# EAGLE board CB_1-2 (EAGLE 7.2.0), part 1 of 3
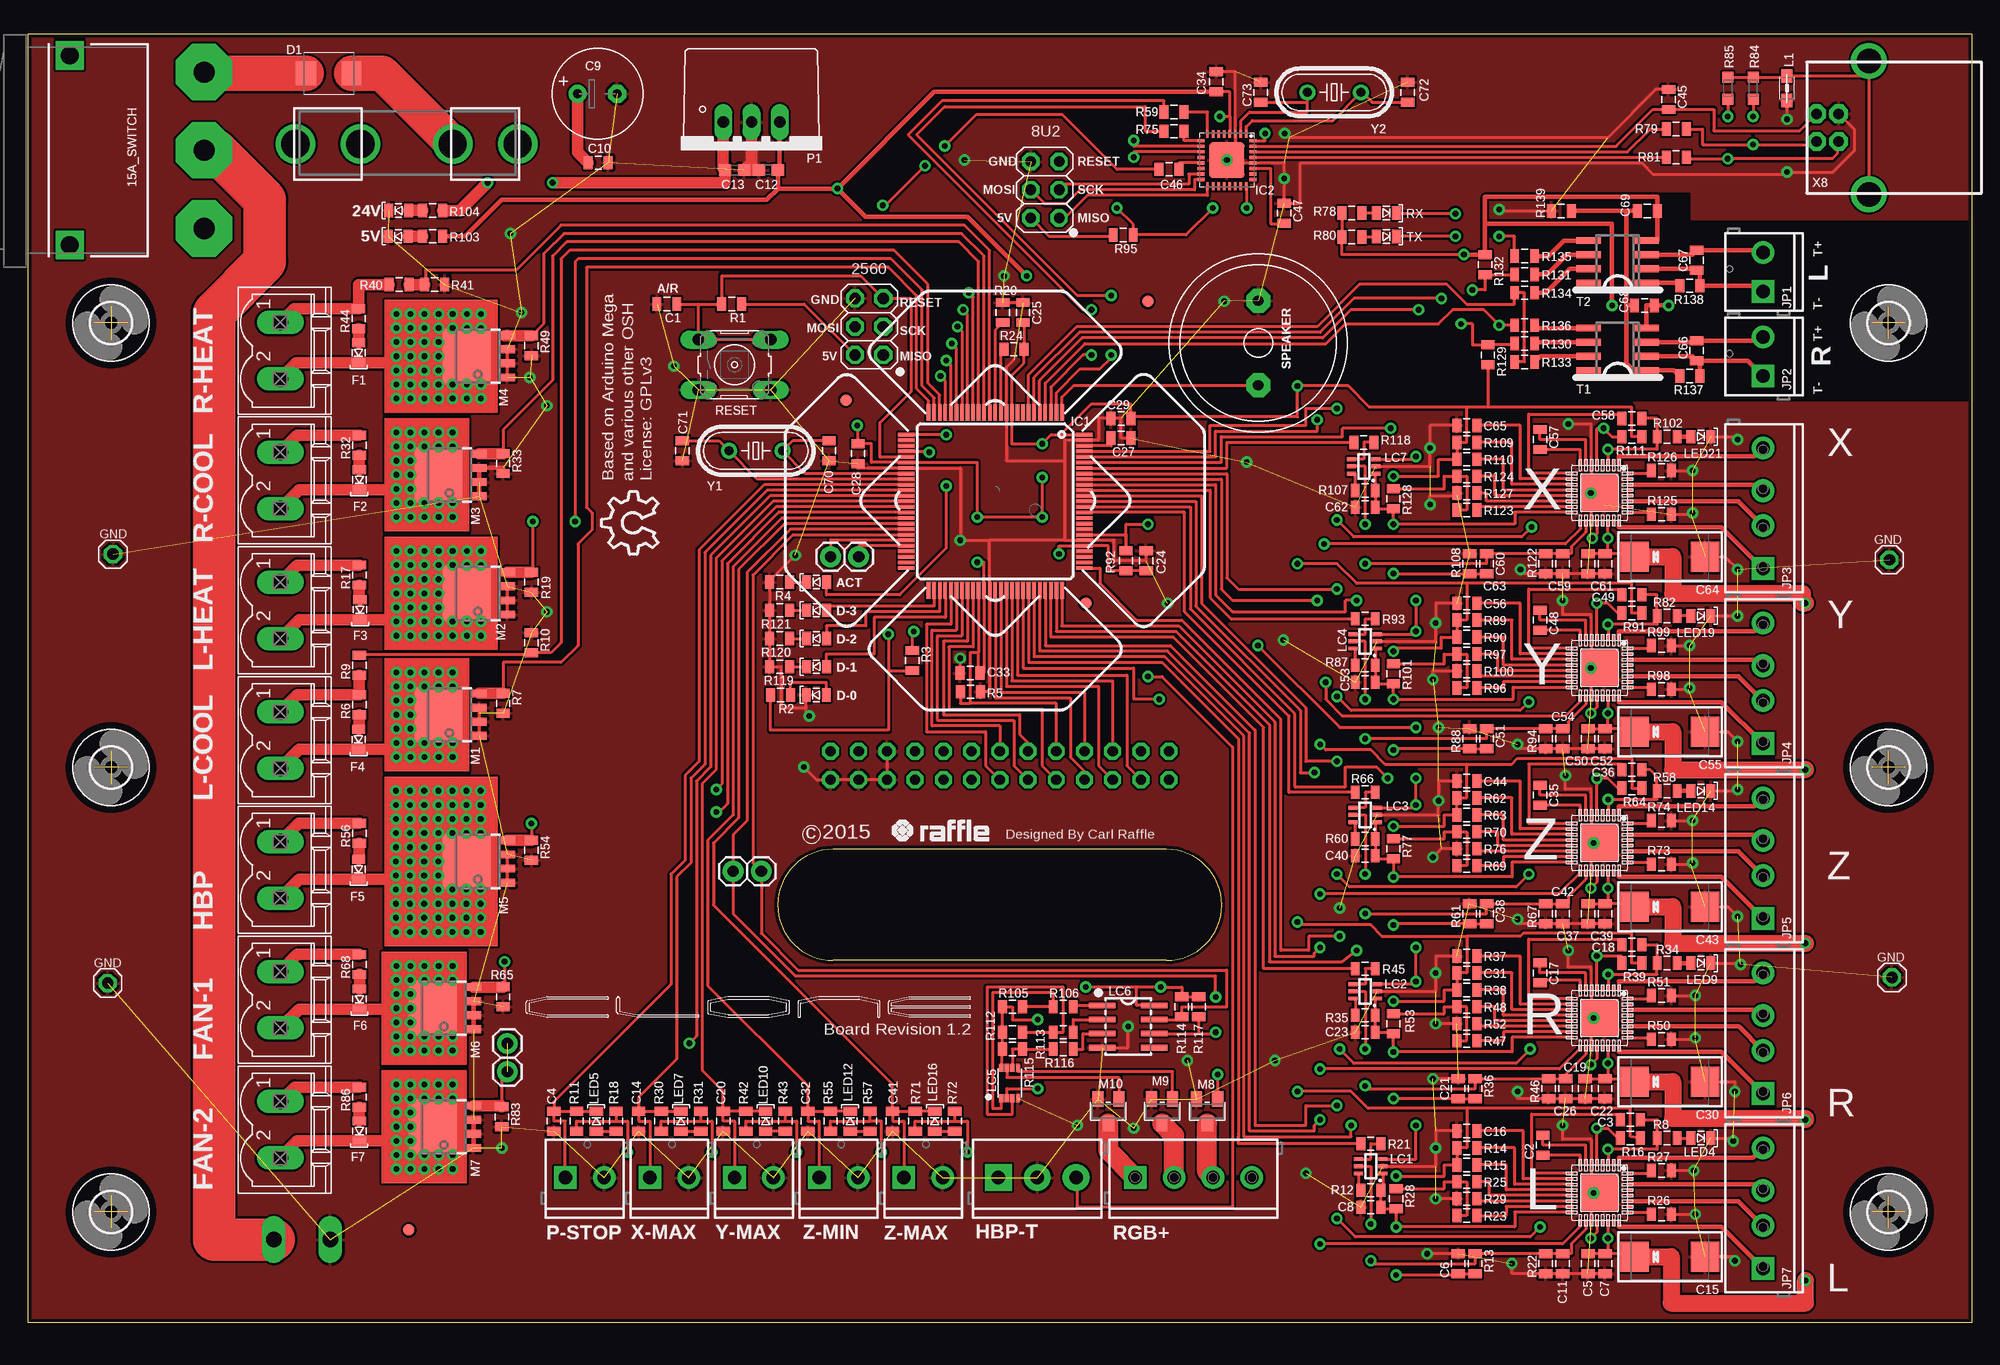
[diagram p5: board, top side]
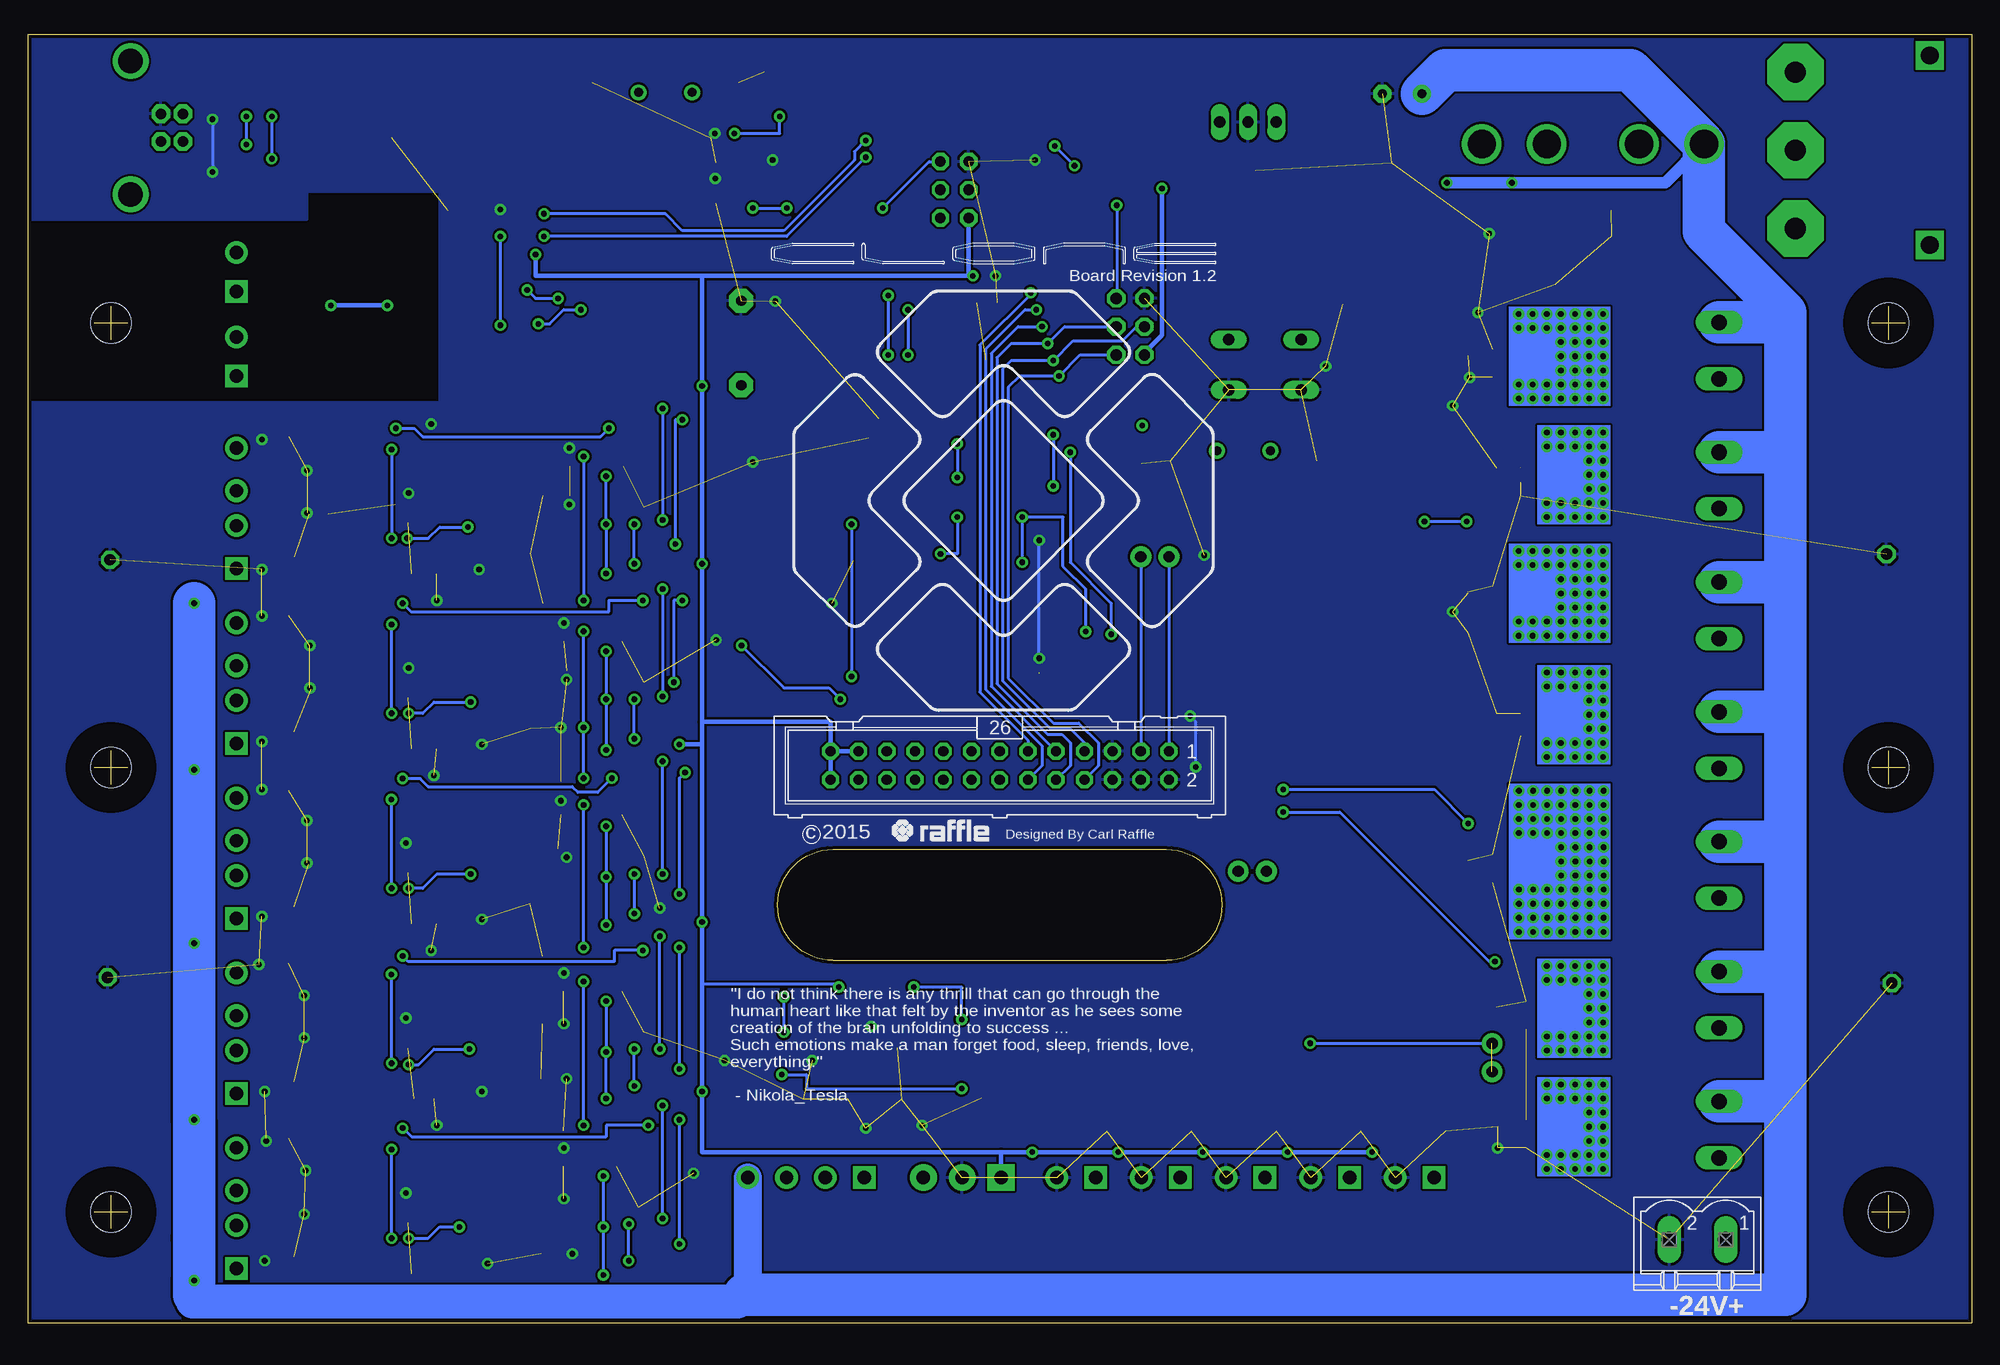
[diagram p6: board, bottom side, seen from below]

Size 175 x 116 mm. Coordinates in mm from the lower left corner, seen from the top.
Outline: 167.5,88.5 167.5,91.5
Outline: 169,90 166,90
Outline: 7.5,91.5 7.5,88.5
Outline: 9,90 6,90
Outline: 167.5,48.5 167.5,51.5
Outline: 169,50 166,50
Outline: 7.5,51.5 7.5,48.5
Outline: 9,50 6,50
Outline: 167.5,8.5 167.5,11.5
Outline: 169,10 166,10
Outline: 7.5,11.5 7.5,8.5
Outline: 9,10 6,10
Outline: 175,116 175,0 0,0 0,116 175,116
Outline: 102.5,42.62 72.5,42.62 arc180 72.5,32.62 102.5,32.62 arc180 102.5,42.62
Copper layers (1*16): Top 0.035mm / dielectric 1.5mm / Bottom 0.035mm
Design rules "default *": minimum track width 8mil, minimum drill 20mil, track to track 8mil, track to pad 8mil, pad to pad 8mil, via to via 8mil, smd to smd 8mil, copper to edge 10mil, drill to drill 8mil, minimum pad ring 12mil, minimum via ring 10mil, stop-mask expansion 4mil, vias tented up to drill 25mil, thermal gap 10mil
Net classes: 0 default: width 0.203 mm, drill 0.508 mm, clearance 0.203 mm; 1 24V: width 0.889 mm, drill 0.635 mm, clearance 0.508 mm; 2 gnd: width 0.381 mm, drill 0.508 mm, clearance 0.254 mm; 3 5V: width 0.381 mm, drill 0.508 mm, clearance 0.254 mm; 4 3.3V: width 0.381 mm, drill 0.508 mm, clearance 0.254 mm

## Footprints (pad centres in the part's own frame; a part is rotated, then mirrored left to right if it is on the bottom)
LED-0805 = smd 1.2 x 0.8: A 0,-0.9; C 0,0.9
D501JT2S2APQF = drill 1.905 pad 5.08 octagon: 1 0,0; 1A 0,7.036; 1B 0,-7.036 | drill 1.6 pad 2.54 square: SLD1 -12.09,8.534; SLD2 -12.09,-8.534
MSTBV2 = drill 1.397 long: 1 -2.54,0; 2 2.54,0
ETSSOP32 = smd 2.54 x 1.27: EPAD 2.098,3.566; EPAD1 2.098,2.296; EPAD2 2.098,1.433 | smd 1.27 x 2.54: EPAD3 3.597,2.936; EPAD4 3.597,2.073 | smd 0.305 x 0.61: P01 0.767,-0.183; P02 1.26,-0.183; P03 1.753,-0.183; P04 2.271,-0.183; P05 2.761,-0.18; P06 3.264,-0.183; P07 3.764,-0.183; P08 4.27,-0.183; P17 4.26,5.207; P18 3.764,5.204; P19 3.272,5.207; P20 2.771,5.204; P21 2.263,5.207; P22 1.76,5.207; P23 1.27,5.207; P24 0.767,5.207 | smd 0.61 x 0.305: P09 5.204,0.759; P10 5.204,1.257; P11 5.204,1.755; P12 5.204,2.263; P13 5.207,2.756; P14 5.207,3.254; P15 5.207,3.759; P16 5.207,4.257; P25 -0.178,4.262; P26 -0.178,3.764; P27 -0.178,3.261; P28 -0.178,2.766; P29 -0.178,2.263; P30 -0.178,1.765; P31 -0.178,1.26; P32 -0.175,0.754
0805 = smd 0.8 x 1.2: 1 -0.9,0; 2 0.9,0
E3,5-8 = drill 0.813 pad 1.6: + -1.778,0 | drill 0.813 pad 1.6 octagon: - 1.778,0
C0603 = smd 1.1 x 1: 1 -0.85,0; 2 0.85,0
EIA7343-31/D-R = smd 2.55 x 2.7: + 3.175,0; - -3.175,0
SMBJ = smd 1.78 x 2.16: A 2.04,0; C -2.03,0
FIDUCIA-MOUNT = smd 1.016 x 1.016: P$1 0,0
FUSE_5MM = drill 2.54 pad 3.556: 1 0,-10; 2 0,-4.158; 3 0,4.158; 4 0,10
SCREWTERMINAL-3.5MM-3 = drill 1.2 pad 2.413 square: 1 0,0 | drill 1.2 pad 2.413: 2 3.5,0; 3 7,0
TQFP100 = smd 0.35 x 1.5: 1 -0.35,1.65; 2 -0.85,1.65; 3 -1.35,1.65; 4 -1.85,1.65; 5 -2.35,1.65; 6 -2.85,1.65; 7 -3.35,1.65; 8 -3.85,1.65; 9 -4.35,1.65; 10 -4.85,1.65; 11 -5.35,1.65; 12 -5.85,1.65; 13 -6.35,1.65; 14 -6.85,1.65; 15 -7.35,1.65; 16 -7.85,1.65; 17 -8.35,1.65; 18 -8.85,1.65; 19 -9.35,1.65; 20 -9.85,1.65; 21 -10.35,1.65; 22 -10.85,1.65; 23 -11.35,1.65; 24 -11.85,1.65; 25 -12.35,1.65; 51 -12.35,-14.35; 52 -11.85,-14.35; 53 -11.35,-14.35; 54 -10.85,-14.35; 55 -10.35,-14.35; 56 -9.85,-14.35; 57 -9.35,-14.35; 58 -8.85,-14.35; 59 -8.35,-14.35; 60 -7.85,-14.35; 61 -7.35,-14.35; 62 -6.85,-14.35; 63 -6.35,-14.35; 64 -5.85,-14.35; 65 -5.35,-14.35; 66 -4.85,-14.35; 67 -4.35,-14.35; 68 -3.85,-14.35; 69 -3.35,-14.35; 70 -2.85,-14.35; 71 -2.35,-14.35; 72 -1.85,-14.35; 73 -1.35,-14.35; 74 -0.85,-14.35; 75 -0.35,-14.35 | smd 1.5 x 0.35: 26 -14.35,-0.35; 27 -14.35,-0.85; 28 -14.35,-1.35; 29 -14.35,-1.85; 30 -14.35,-2.35; 31 -14.35,-2.85; 32 -14.35,-3.35; 33 -14.35,-3.85; 34 -14.35,-4.35; 35 -14.35,-4.85; 36 -14.35,-5.35; 37 -14.35,-5.85; 38 -14.35,-6.35; 39 -14.35,-6.85; 40 -14.35,-7.35; 41 -14.35,-7.85; 42 -14.35,-8.35; 43 -14.35,-8.85; 44 -14.35,-9.35; 45 -14.35,-9.85; 46 -14.35,-10.35; 47 -14.35,-10.85; 48 -14.35,-11.35; 49 -14.35,-11.85; 50 -14.35,-12.35; 76 1.65,-12.35; 77 1.65,-11.85; 78 1.65,-11.35; 79 1.65,-10.85; 80 1.65,-10.35; 81 1.65,-9.85; 82 1.65,-9.35; 83 1.65,-8.85; 84 1.65,-8.35; 85 1.65,-7.85; 86 1.65,-7.35; 87 1.65,-6.85; 88 1.65,-6.35; 89 1.65,-5.85; 90 1.65,-5.35; 91 1.65,-4.85; 92 1.65,-4.35; 93 1.65,-3.85; 94 1.65,-3.35; 95 1.65,-2.85; 96 1.65,-2.35; 97 1.65,-1.85; 98 1.65,-1.35; 99 1.65,-0.85; 100 1.65,-0.35
ATMEL_QFN32 = smd 0.711 x 0.305: 1 -2.351,1.75; 2 -2.351,1.25; 3 -2.351,0.75; 4 -2.351,0.25; 5 -2.351,-0.25; 6 -2.351,-0.75; 7 -2.351,-1.25; 8 -2.351,-1.75; 17 2.351,-1.75; 18 2.351,-1.25; 19 2.351,-0.75; 20 2.351,-0.25; 21 2.351,0.25; 22 2.351,0.75; 23 2.351,1.25; 24 2.351,1.75 | smd 0.305 x 0.711: 9 -1.75,-2.351; 10 -1.25,-2.351; 11 -0.75,-2.351; 12 -0.25,-2.351; 13 0.25,-2.351; 14 0.75,-2.351; 15 1.25,-2.351; 16 1.75,-2.351; 25 1.75,2.351; 26 1.25,2.351; 27 0.75,2.351; 28 0.25,2.351; 29 -0.25,2.351; 30 -0.75,2.351; 31 -1.25,2.351; 32 -1.75,2.351 | smd 3.2 x 3.2: EXP 0,0
SCREWTERMINAL-3.5MM-2 = drill 1.2 pad 2.032 square: 1 0,0 | drill 1.2 pad 2.032: 2 3.5,0
SCREWTERMINAL-3.5MM-4_LOCK = drill 1.2 pad 2.032 square: 1 -0.178,0 | drill 1.2 pad 2.032: 2 3.678,0; 3 6.822,0; 4 10.678,0
0805' = smd 1.2 x 1: 1 -1.1,0; 2 1.1,0
SC70-6L = smd 0.35 x 0.8: 1 -0.65,-1.1; 2 0,-1.1; 3 0.65,-1.1; 4 0.65,1.1; 5 0,1.1; 6 -0.65,1.1
VSSOP8 = smd 0.4 x 0.75: 1 -0.75,-1.375; 2 -0.25,-1.375; 3 0.25,-1.375; 4 0.75,-1.375; 5 0.75,1.375; 6 0.25,1.375; 7 -0.25,1.375; 8 -0.75,1.375
SO8 = smd 0.5 x 2.388: 1 -1.905,-2.324; 2 -0.635,-2.324; 3 0.635,-2.324; 4 1.905,-2.324; 5 1.905,2.324; 6 0.635,2.324; 7 -0.635,2.324; 8 -1.905,2.324
SOT669 = smd 0.7 x 1.4: 1 -1.905,-3.92; 2 -0.635,-3.92; 3 0.635,-3.92; 4 1.905,-3.92 | smd 5 x 4.3: MB 0,-0.27
SOT-23 = smd 1 x 1.4: 1 -0.95,-1.1; 2 0.95,-1.1; 3 0,1.1
R-78 = drill 1.016 long: 1 -2.54,2.54; 2 0,2.54; 3 2.54,2.54
2X03 = drill 1.016 octagon: 1 -2.54,-1.27; 2 -2.54,1.27; 3 0,-1.27; 4 0,1.27; 5 2.54,-1.27; 6 2.54,1.27
2X03' = drill 0.95 pad 1.55 octagon: 1 -2.54,-1.27; 2 -2.54,1.27; 3 0,-1.27; 4 0,1.27; 5 2.54,-1.27; 6 2.54,1.27
1X01 = drill 1.016 pad 1.88: 1 0,0
1X01' = drill 1.016 octagon: 1 0,0
CT/CN0603 = smd 1 x 1: 1 -1,0; 2 1,0
B3F-10XX = drill 1.016 long: 1 -3.251,2.261; 2 3.251,2.261; 3 -3.251,-2.261; 4 3.251,-2.261
SCREWTERMINAL-3.5MM-4 = drill 1.2 pad 2.032 square: 1 0,0 | drill 1.2 pad 2.032: 2 3.5,0; 3 7,0; 4 10.5,0
F/QMB = drill 0.914 pad 2.159 octagon: + 3.81,0; - -3.81,0
ML26 = drill 0.914 octagon: 1 -15.24,-1.27; 2 -15.24,1.27; 3 -12.7,-1.27; 4 -12.7,1.27; 5 -10.16,-1.27; 6 -10.16,1.27; 7 -7.62,-1.27; 8 -7.62,1.27; 9 -5.08,-1.27; 10 -5.08,1.27; 11 -2.54,-1.27; 12 -2.54,1.27; 13 0,-1.27; 14 0,1.27; 15 2.54,-1.27; 16 2.54,1.27; 17 5.08,-1.27; 18 5.08,1.27; 19 7.62,-1.27; 20 7.62,1.27; 21 10.16,-1.27; 22 10.16,1.27; 23 12.7,-1.27; 24 12.7,1.27; 25 15.24,-1.27; 26 15.24,1.27
SO08 = smd 0.6 x 2.2: 1 -1.905,-2.6; 2 -0.635,-2.6; 3 0.635,-2.6; 4 1.905,-2.6; 5 1.905,2.6; 6 0.635,2.6; 7 -0.635,2.6; 8 -1.905,2.6
3,6 = hole 3.6: 0,0
PN61729 = drill 0.95 pad 1.676 octagon: 1 1.25,4.71; 2 -1.25,4.71; 3 -1.25,2.71; 4 1.25,2.71 | drill 2.2: P$1 -6,0; P$2 6,0
HC49/S = drill 0.813: 1 -2.413,0; 2 2.413,0

## Placement (x,y rotation side)
5V  BLUE  [LED-0805]  33.35,97.79 90 top
15A_SWITCH  PWRSWITCH  [D501JT2S2APQF]  15.88,105.54 0 top
24V  GREEN  [LED-0805]  33.38,100.12 90 top
-24V+  MSTBV2  [MSTBV2]  24.69,7.49 180 bottom
A1  A4982ETSSOP32  [ETSSOP32]  144.02,14.22 180 top
A2  A4982ETSSOP32  [ETSSOP32]  144.02,29.95 180 top
A3  A4982ETSSOP32  [ETSSOP32]  144.02,45.72 180 top
A4  A4982ETSSOP32  [ETSSOP32]  144.02,61.47 180 top
A5  A4982ETSSOP32  [ETSSOP32]  144.02,77.22 180 top
ACT  BLUE  [LED-0805]  70.99,66.67 90 top
C1  22pF  [0805]  57.53,91.69 0 top
C2  100nF  [0805]  136.4,16 270 top
C3  100nF  [0805]  144.27,18.29 180 top
C4  100nF  [0805]  47.37,18.16 270 top
C5  100nF  [0805]  140.46,5.33 90 top
C6  100nF  [0805]  128.78,5.33 270 top
C7  100nF  [0805]  141.99,5.33 90 top
C8  100nF  [0805]  120.9,10.41 0 top
C9  100uF - 63V  [E3,5-8]  51.28,110.62 0 top
C10  100nF  [0805]  51.36,104.41 0 top
C11  100nF  [0805]  138.18,5.33 90 top
C12  .1uF  [C0603]  66.67,103.76 180 top
C13  .33uF  [C0603]  63.63,103.76 0 top
C14  100nF  [0805]  54.99,18.16 270 top
C15  47uF - 35V  [EIA7343-31/D-R]  147.83,5.97 180 top
C16  0.22uF  [0805]  129.54,17.27 180 top
C17  100nF  [0805]  136.14,31.5 270 top
C18  100nF  [0805]  144.4,34.04 180 top
C19  100nF  [0805]  140.21,21.08 90 top
C20  100nF  [0805]  62.61,18.16 270 top
C21  100nF  [0805]  128.78,21.08 270 top
C22  100nF  [0805]  141.99,21.08 90 top
C23  100nF  [0805]  120.4,26.16 0 top
C24  100nF  [0805]  100.67,68.6 90 top
C25  100nF  [0805]  89.6,90.93 90 top
C26  100nF  [0805]  138.43,21.08 90 top
C27  100nF  [0805]  98.42,79.63 0 top
C28  100nF  [0805]  74.74,78.23 270 top
C29  100nF  [0805]  98.42,81.41 180 top
C30  47uF - 35V  [EIA7343-31/D-R]  147.83,21.72 180 top
C31  0.22uF  [0805]  129.54,33.02 180 top
C32  100nF  [0805]  70.23,18.16 270 top
C33  100nF  [0805]  84.84,58.48 180 top
C34  100nF  [0805]  107,111.7 270 top
C35  100nF  [0805]  136.14,47.5 270 top
C36  100nF  [0805]  144.4,49.78 180 top
C37  100nF  [0805]  140.46,36.83 90 top
C38  100nF  [0805]  129.79,36.83 270 top
C39  100nF  [0805]  141.99,36.83 90 top
C40  100nF  [0805]  120.4,42.04 0 top
C41  100nF  [0805]  77.85,18.16 270 top
C42  100nF  [0805]  138.18,36.83 90 top
C43  47uF - 35V  [EIA7343-31/D-R]  147.83,37.47 180 top
C44  0.22uF  [0805]  129.54,48.77 180 top
C45  100nF  [0805]  147.7,110.11 270 top
C46  100nF  [0805]  102.74,103.82 180 top
C47  1uF  [0805]  113.09,99.89 270 top
C48  100nF  [0805]  136.14,63.25 270 top
C49  100nF  [0805]  144.4,65.53 180 top
C50  100nF  [0805]  140.46,52.58 90 top
C51  100nF  [0805]  129.79,52.58 270 top
C52  100nF  [0805]  141.99,52.58 90 top
C53  100nF  [0805]  120.4,57.66 0 top
C54  100nF  [0805]  138.18,52.58 90 top
C55  47uF - 35V  [EIA7343-31/D-R]  147.83,53.21 180 top
C56  0.22uF  [0805]  129.54,64.77 180 top
C57  100nF  [0805]  136.14,79.5 270 top
C58  100nF  [0805]  144.4,81.41 180 top
C59  100nF  [0805]  140.46,68.33 90 top
C60  100nF  [0805]  129.79,68.33 270 top
C61  100nF  [0805]  141.99,68.33 90 top
C62  100nF  [0805]  120.4,73.41 0 top
C63  100nF  [0805]  138.18,68.33 90 top
C64  47uF - 35V  [EIA7343-31/D-R]  147.83,68.96 180 top
C65  0.22uF  [0805]  129.54,80.77 180 top
C66  100nF  [0805]  150.24,87.5 270 top
C67  100nF  [0805]  150.24,95.63 270 top
C68  100nF  [0805]  145.54,91.57 0 top
C69  100nF  [0805]  145.8,100.08 0 top
C70  22pF  [0805]  72.14,78.49 90 top
C71  22pF  [0805]  58.93,78.49 90 top
C72  22pF  [0805]  124.21,110.74 270 top
C73  22pF  [0805]  111,110.74 270 top
D1  SMBJ24A  [SMBJ]  27.11,112.46 180 top
D-0  BLUE  [LED-0805]  70.98,56.52 90 top
D-1  YELLOW  [LED-0805]  70.99,59.05 90 top
D-2  ORANGE  [LED-0805]  70.99,61.59 90 top
D-3  RED  [LED-0805]  70.99,64.14 90 top
F1  RED  [LED-0805]  29.78,87.31 180 top
F2  Yellow  [LED-0805]  29.84,75.88 180 top
F3  RED  [LED-0805]  29.91,64.2 180 top
F4  Yellow  [LED-0805]  29.78,52.51 180 top
F5  RED  [LED-0805]  29.78,40.83 180 top
F6  Yellow  [LED-0805]  29.86,29.15 180 top
F7  Yellow  [LED-0805]  29.84,17.27 180 top
FAN-1  MSTBV2  [MSTBV2]  22.73,29.08 270 top
FAN-2  MSTBV2  [MSTBV2]  22.73,17.4 270 top
FID1  FIDUCIALMOUNT  [FIDUCIA-MOUNT]  73.66,83.06 0 top
FID2  FIDUCIALMOUNT  [FIDUCIA-MOUNT]  95.25,64.77 0 top
FID3  FIDUCIALMOUNT  [FIDUCIA-MOUNT]  34.29,8.38 0 top
FID4  FIDUCIALMOUNT  [FIDUCIA-MOUNT]  100.84,91.95 0 top
FUSE_HOLDER  FUSEX20MM  [FUSE_5MM]  34.1,106.11 270 top
HBP  MSTBV2  [MSTBV2]  22.73,40.77 270 top
HBP-T  SCREWTERMINAL-3.5MM-3  [SCREWTERMINAL-3.5MM-3]  87.38,13.08 0 top
IC1  ATMEGA2560-16AU  [TQFP100]  93.45,80.29 0 top
IC2  ATMEGA8U2-MU  [ATMEL_QFN32]  107.95,104.65 270 top
JP1  SCREWTERMINAL-3.5MM-2  [SCREWTERMINAL-3.5MM-2]  156.21,92.84 90 top
JP2  SCREWTERMINAL-3.5MM-2  [SCREWTERMINAL-3.5MM-2]  156.21,85.22 90 top
JP3  SCREWTERMINAL-3.5MM-4  [SCREWTERMINAL-3.5MM-4_LOCK]  156.21,68.07 90 top
JP4  SCREWTERMINAL-3.5MM-4  [SCREWTERMINAL-3.5MM-4_LOCK]  156.21,52.32 90 top
JP5  SCREWTERMINAL-3.5MM-4  [SCREWTERMINAL-3.5MM-4_LOCK]  156.21,36.58 90 top
JP6  SCREWTERMINAL-3.5MM-4  [SCREWTERMINAL-3.5MM-4_LOCK]  156.21,20.83 90 top
JP7  SCREWTERMINAL-3.5MM-4  [SCREWTERMINAL-3.5MM-4_LOCK]  156.21,5.08 90 top
L1  BLM21  [0805']  158.37,111.12 90 top
L-COOL  MSTBV2  [MSTBV2]  22.73,52.45 270 top
L-HEAT  MSTBV2  [MSTBV2]  22.73,64.14 270 top
LC1  MCP4018  [SC70-6L]  120.9,14.1 90 top
LC2  MCP4018  [SC70-6L]  120.4,29.84 90 top
LC3  MCP4018  [SC70-6L]  120.4,45.72 90 top
LC4  MCP4018  [SC70-6L]  120.4,61.34 90 top
LC5  74HC3G14DC  [VSSOP8]  88.39,21.59 0 top
LC6  PCA9533  [SO8]  99.06,26.67 270 top
LC7  MCP4018  [SC70-6L]  120.27,77.09 90 top
LED4  GREEN  [LED-0805]  150.62,16.64 270 top
LED5  GREEN  [LED-0805]  51.18,18.16 0 top
LED7  GREEN  [LED-0805]  58.8,18.16 0 top
LED9  GREEN  [LED-0805]  150.62,32.38 270 top
LED10  GREEN  [LED-0805]  66.42,18.16 0 top
LED12  GREEN  [LED-0805]  74.04,18.16 0 top
LED14  GREEN  [LED-0805]  150.62,47.88 270 top
LED16  GREEN  [LED-0805]  81.66,18.16 0 top
LED19  GREEN  [LED-0805]  150.62,63.63 270 top
LED21  GREEN  [LED-0805]  150.62,79.76 270 top
LOGO2  OSHW_LOGO_10MILX0200-NT  [OSHW_10X200_NOTEXT]  56.74,69.16 90 top
M1  PSMN7R0-30YL  [SOT669]  36.7,54.74 90 top
M2  PSMN7R0-30YL  [SOT669]  39.24,65.66 90 top
M3  PSMN7R0-30YL  [SOT669]  36.7,76.31 90 top
M4  PSMN7R0-30YL  [SOT669]  39.24,87 90 top
M5  PSMN7R0-30YL  [SOT669]  39.24,41.53 90 top
M6  PSMN7R0-30YL  [SOT669]  36.2,28.32 90 top
M7  PSMN7R0-30YL  [SOT669]  36.2,17.65 90 top
M8  FDV301N  [SOT-23]  106.17,19.05 180 top
M9  FDV301N  [SOT-23]  102.11,19.05 180 top
M10  FDV301N  [SOT-23]  97.28,19.05 180 top
P1  R-78E-5.0  [R-78]  65.15,105.54 0 top
P-STOP  SCREWTERMINAL-3.5MM-2  [SCREWTERMINAL-3.5MM-2]  48.39,13.08 0 top
PIN1  2560-ICSP  [2X03]  75.74,89.66 90 top
PIN2  8U2  [2X03']  91.57,101.98 90 top
PIN3  DNP  [1X01]  72.26,68.96 0 top
PIN4  DNP  [1X01]  74.8,68.96 0 top
PIN5  DNP  [1X01]  63.5,40.64 0 top
PIN6  DNP  [1X01]  66.04,40.64 0 top
PIN7  DNP  [1X01]  43.18,25.15 0 top
PIN8  DNP  [1X01]  43.18,22.61 90 top
PIN9  DNP  [1X01']  7.67,69.19 180 top
PIN10  DNP  [1X01']  7.19,30.58 180 top
PIN11  DNP  [1X01']  167.82,31.09 180 top
PIN12  DNP  [1X01']  167.59,68.68 180 top
R1  10K  [0805]  63.37,91.69 0 top
R2  1K  [0805]  67.77,56.52 0 top
R3  10k  [0805]  79.63,59.61 90 top
R4  1K  [0805]  67.69,66.67 0 top
R5  10K  [0805]  84.86,56.81 180 top
R6  2.21K  [0805]  29.84,55.63 90 top
R7  4.7K  [0805]  42.8,55.75 90 top
R8  6.8k  [0805]  147.57,16.64 180 top
R9  10k  [0805]  29.84,59.18 270 top
R10  2.21K  [0805]  45.34,61.21 270 top
R11  4.7K  [0805]  49.4,18.16 270 top
R12  10K  [0805]  120.9,11.94 0 top
R13  33K  [0805]  130.3,5.33 90 top
R14  2.2K  [0805]  129.54,15.75 0 top
R15  2.2K  [0805]  129.54,14.22 0 top
R16  4.7K  [0805]  144.27,16.64 0 top
R17  2.21K  [0805]  29.84,67.31 90 top
R18  1K  [0805]  52.96,18.16 90 top
R19  4.7K  [0805]  45.34,66.67 90 top
R20  10k  [0805]  87.76,90.93 270 top
R21  1K  [0805]  120.9,16.13 180 top
R22  12K  [0805]  136.65,5.33 270 top
R23  4.7K  [0805]  129.54,9.65 180 top
R24  10k  [0805]  88.77,87.63 0 top
R25  4.7K  [0805]  129.54,12.7 180 top
R26  0.27  [0805]  147.07,9.78 180 top
R27  0.27  [0805]  147.07,13.72 180 top
R28  10K  [0805]  123.19,11.18 270 top
R29  0  [0805]  129.54,11.18 180 top
R30  4.7K  [0805]  57.02,18.16 270 top
R31  1K  [0805]  60.58,18.16 90 top
R32  2.21K  [0805]  29.84,78.99 90 top
R33  4.7K  [0805]  42.8,77.34 90 top
R34  6.8k  [0805]  147.57,32.38 180 top
R35  10K  [0805]  120.4,27.69 0 top
R36  33K  [0805]  130.3,21.08 90 top
R37  2.2K  [0805]  129.54,31.5 0 top
R38  2.2K  [0805]  129.54,29.97 0 top
R39  4.7K  [0805]  144.4,32.38 0 top
R40  10k  [0805]  33.43,93.45 180 top
R41  2.21K  [0805]  36.63,93.45 180 top
R42  4.7K  [0805]  64.64,18.16 270 top
R43  1K  [0805]  68.2,18.16 90 top
R44  2.21K  [0805]  29.79,90.39 90 top
R45  1K  [0805]  120.4,31.88 180 top
R46  12K  [0805]  136.91,21.08 270 top
R47  4.7K  [0805]  129.54,25.4 180 top
R48  4.7K  [0805]  129.54,28.45 180 top
R49  4.7K  [0805]  45.34,87.95 90 top
R50  0.27  [0805]  147.07,25.53 180 top
R51  0.27  [0805]  147.07,29.46 180 top
R52  0  [0805]  129.54,26.92 180 top
R53  10K  [0805]  122.94,26.92 270 top
R54  4.7K  [0805]  45.34,42.55 90 top
R55  4.7K  [0805]  72.26,18.16 270 top
R56  2.21K  [0805]  29.84,44.07 90 top
R57  1K  [0805]  75.82,18.16 90 top
R58  6.8k  [0805]  147.57,47.88 180 top
R59  1K  [0805]  103.19,108.97 0 top
R60  10K  [0805]  120.4,43.56 0 top
R61  33K  [0805]  131.32,36.83 90 top
R62  2.2K  [0805]  129.54,47.24 0 top
R63  2.2K  [0805]  129.54,45.72 0 top
R64  4.7K  [0805]  144.4,48.13 0 top
R65  4.7K  [0805]  42.8,29.34 90 top
R66  1K  [0805]  120.4,47.75 180 top
R67  12K  [0805]  136.65,36.83 270 top
R68  2.21K  [0805]  29.84,32.26 90 top
R69  4.7K  [0805]  129.54,41.15 180 top
R70  4.7K  [0805]  129.54,44.2 180 top
R71  4.7K  [0805]  79.88,18.16 270 top
R72  1K  [0805]  83.44,18.16 90 top
R73  0.27  [0805]  147.07,41.27 180 top
R74  0.27  [0805]  147.07,45.21 180 top
R75  1K  [0805]  103.19,107.25 0 top
R76  0  [0805]  129.54,42.67 180 top
R77  10K  [0805]  122.94,42.67 270 top
R78  1K  [0805]  119.19,99.89 0 top
R79  22  [0805]  148.4,107.44 0 top
R80  1K  [0805]  119.19,97.73 0 top
R81  22  [0805]  148.4,104.9 0 top
R82  6.8k  [0805]  147.57,63.63 180 top
R83  4.7K  [0805]  42.67,18.54 90 top
R84  PGB1010604  [CT/CN0603]  155.32,111.12 270 top
R85  PGB1010604  [CT/CN0603]  153.03,111.12 270 top
R86  2.21K  [0805]  29.84,20.32 90 top
R87  10K  [0805]  120.4,59.18 0 top
R88  33K  [0805]  131.32,52.58 90 top
R89  2.2K  [0805]  129.54,63.25 0 top
R90  2.2K  [0805]  129.54,61.72 0 top
R91  4.7K  [0805]  144.4,63.88 0 top
R92  100K  [0805]  98.87,68.6 270 top
R93  1K  [0805]  120.4,63.37 180 top
R94  12K  [0805]  136.65,52.58 270 top
R95  10K  [0805]  98.62,97.92 180 top
R96  4.7K  [0805]  129.54,57.15 180 top
R97  4.7K  [0805]  129.54,60.2 180 top
R98  0.27  [0805]  147.07,57.02 180 top
R99  0.27  [0805]  147.07,60.96 180 top
R100  0  [0805]  129.54,58.67 180 top
R101  10K  [0805]  122.94,58.42 270 top
R102  6.8k  [0805]  147.57,79.76 180 top
R103  1K  [0805]  36.45,97.79 180 top
R104  2.2K  [0805]  36.45,100.11 0 top
R105  1M  [0805]  88.65,28.45 0 top
R106  100K  [0805]  93.22,28.45 0 top
R107  10K  [0805]  120.4,74.93 0 top
R108  33K  [0805]  131.32,68.33 90 top
R109  2.2K  [0805]  129.54,79.25 0 top
R110  2.2K  [0805]  129.54,77.72 0 top
R111  4.7K  [0805]  144.4,79.76 0 top
R112  1M  [0805]  88.65,26.16 0 top
R113  100K  [0805]  93.22,26.16 0 top
R114  4.7K  [0805]  103.89,28.45 90 top
R115  1M  [0805]  88.65,24.64 0 top
R116  100K  [0805]  93.22,24.64 0 top
R117  4.7K  [0805]  105.41,28.45 90 top
R118  1K  [0805]  120.27,79.25 180 top
R119  1K  [0805]  67.69,59.05 0 top
R120  1K  [0805]  67.69,61.59 0 top
R121  1K  [0805]  67.69,64.14 0 top
R122  12K  [0805]  136.65,68.33 270 top
R123  4.7K  [0805]  129.54,73.15 180 top
R124  4.7K  [0805]  129.54,76.2 180 top
R125  0.27  [0805]  147.07,72.77 180 top
R126  0.27  [0805]  147.07,76.71 180 top
R127  0  [0805]  129.54,74.68 180 top
R128  10K  [0805]  122.94,74.17 270 top
R129  10K  [0805]  131.44,87.12 270 top
R130  0  [0805]  134.75,88.14 0 top
R131  0  [0805]  134.75,94.36 0 top
R132  10K  [0805]  131.19,95.25 90 top
R133  4.7K  [0805]  134.75,86.49 0 top
R134  4.7K  [0805]  134.75,92.71 0 top
R135  0  [0805]  134.75,96.01 0 top
R136  0  [0805]  134.75,89.79 0 top
R137  0  [0805]  149.61,85.22 180 top
R138  0  [0805]  149.61,93.34 180 top
R139  0  [0805]  138.05,100.08 180 top
R-COOL  MSTBV2  [MSTBV2]  22.73,75.82 270 top
R-HEAT  MSTBV2  [MSTBV2]  22.73,87.5 270 top
RESET  Push-button  [B3F-10XX]  63.63,86.23 0 top
RGB+  SCREWTERMINAL-3.5MM-4  [SCREWTERMINAL-3.5MM-4]  99.69,13.08 0 top
RX  YELLOW  [LED-0805]  122.3,99.89 270 top
SPEAKER  F/QMB  [F/QMB]  110.77,88.19 270 top
SV2  26 Pin - Male  [ML26]  87.5,50.16 180 bottom
T1  MAX6675  [SO08]  143.13,87.63 90 top
T2  MAX6675  [SO08]  143.13,95.5 90 top
TX  YELLOW  [LED-0805]  122.3,97.79 270 top
U$1  [3,6]  7.49,89.99 0 top
U$2  [3,6]  7.49,49.99 0 top
U$3  [3,6]  7.49,9.98 0 top
U$4  [3,6]  167.51,89.99 0 top
U$5  [3,6]  167.51,49.99 0 top
U$6  [3,6]  167.51,9.98 0 top
X8  USB B-TH  [PN61729]  165.74,107.57 90 top
X-MAX  SCREWTERMINAL-3.5MM-2  [SCREWTERMINAL-3.5MM-2]  56.01,13.08 0 top
Y1  16MHz  [HC49/S]  65.53,78.49 0 top
Y2  16MHz  [HC49/S]  117.6,110.74 0 top
Y-MAX  SCREWTERMINAL-3.5MM-2  [SCREWTERMINAL-3.5MM-2]  63.63,13.08 0 top
Z-MAX  SCREWTERMINAL-3.5MM-2  [SCREWTERMINAL-3.5MM-2]  78.87,13.08 0 top
Z-MIN  SCREWTERMINAL-3.5MM-2  [SCREWTERMINAL-3.5MM-2]  71.25,13.08 0 top